# EAGLE design DispenserV2.0 (EAGLE 9.3.1)

## Sheet 1 of 2
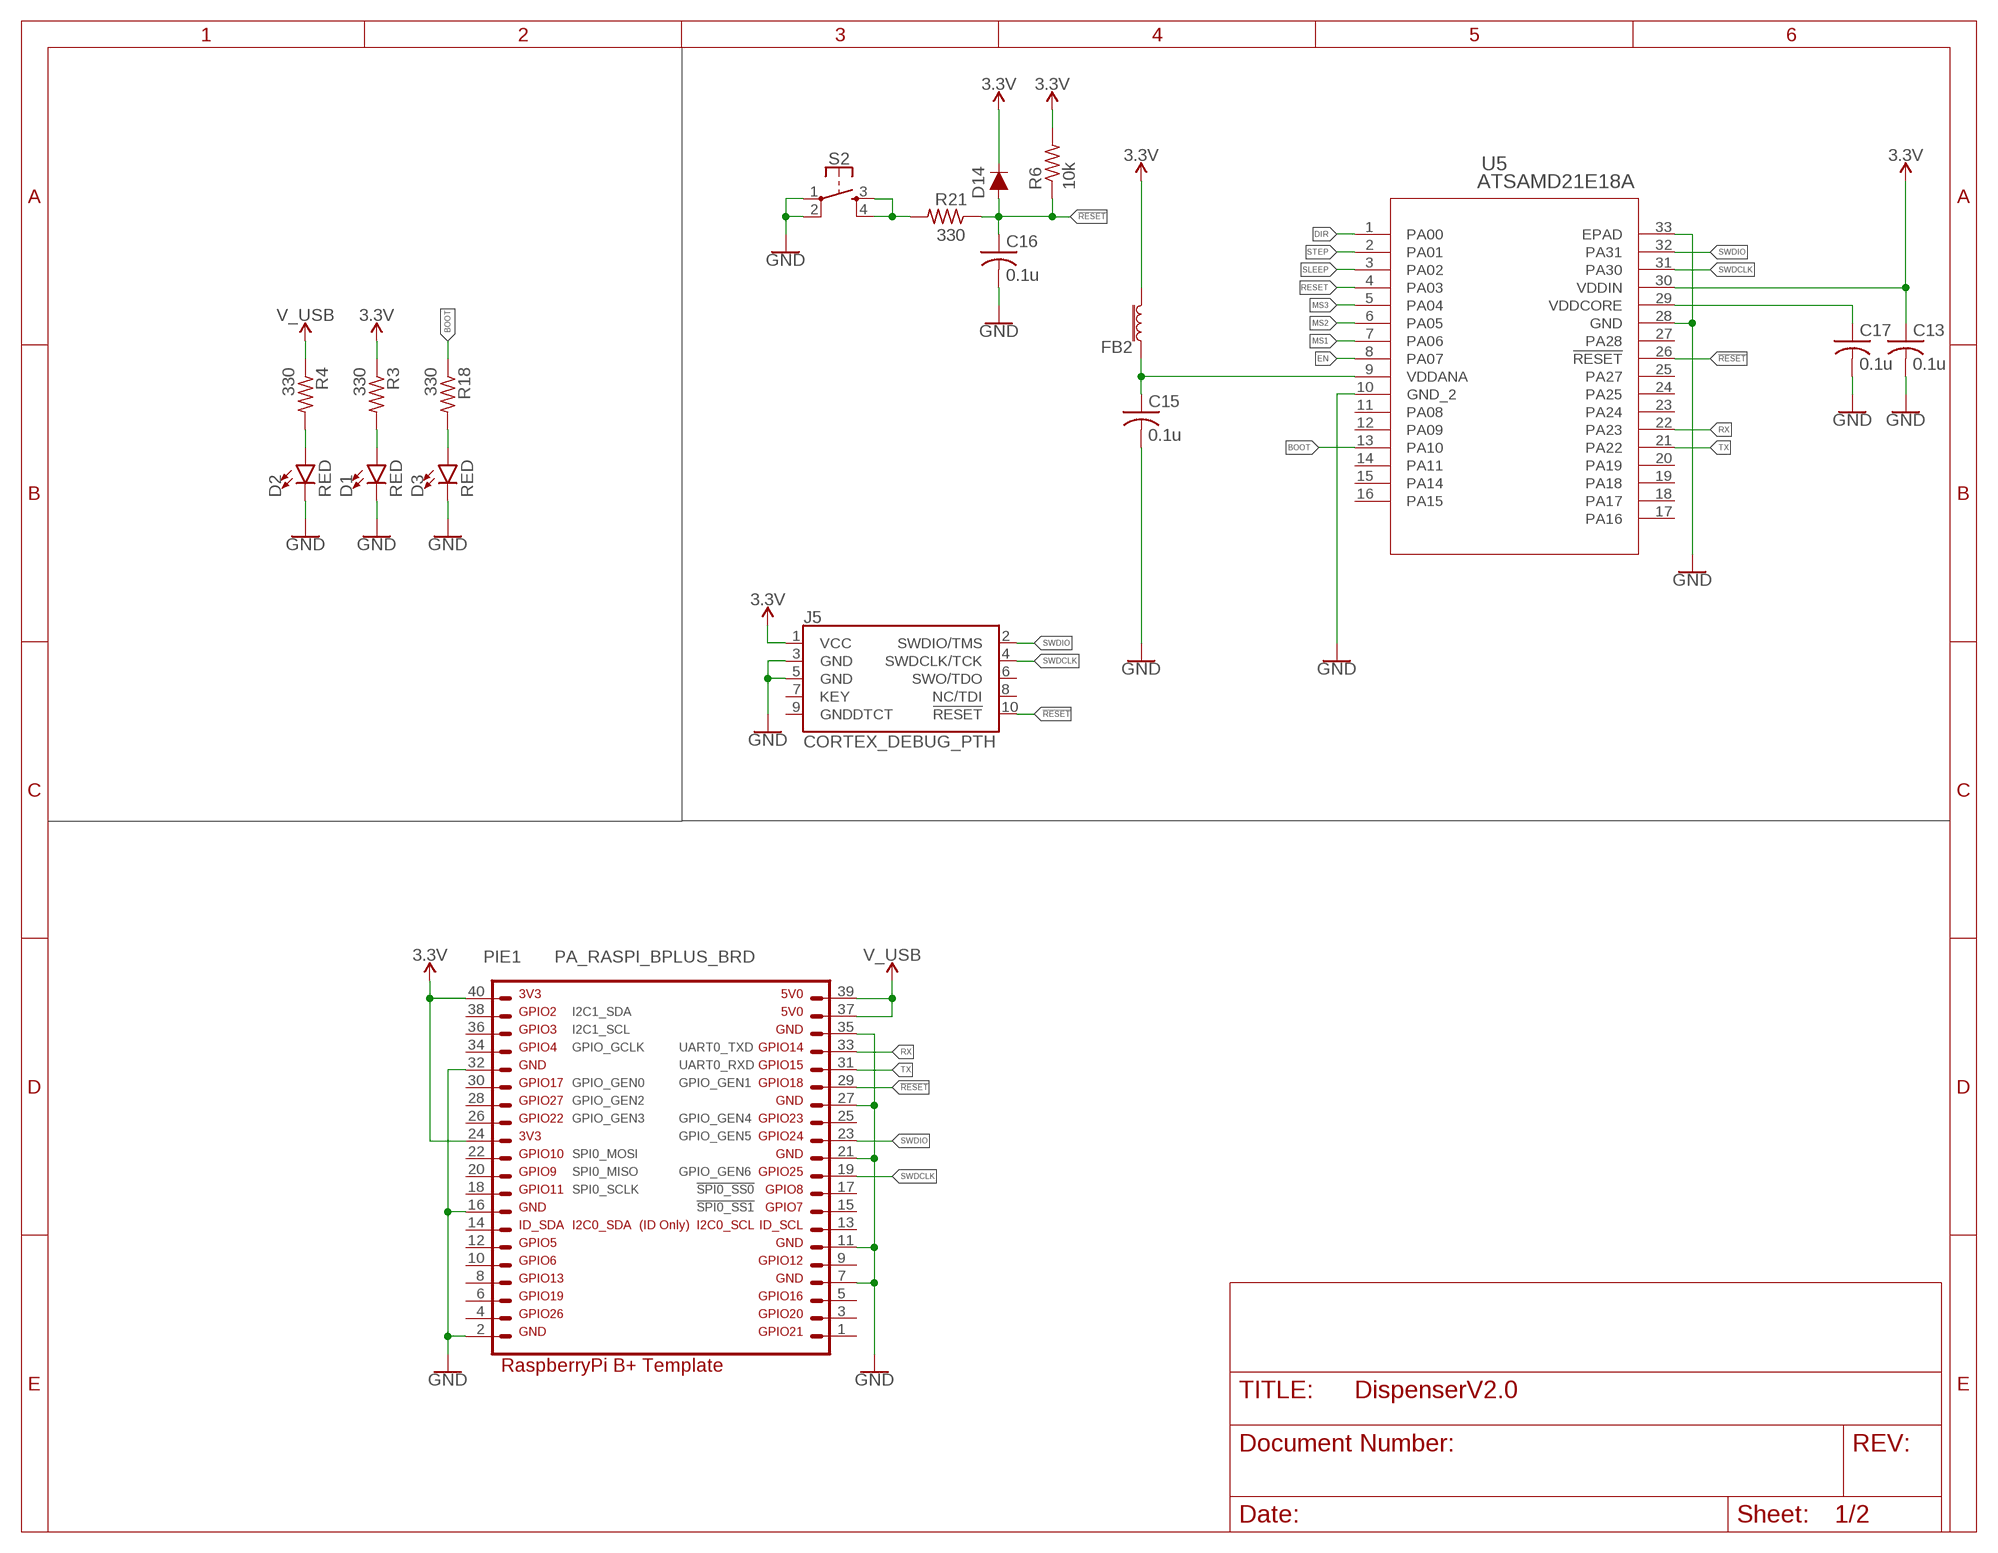
[diagram p0: schematic, sheet 1]

### Parts
C13  0.1u  C-USC0603K  [C0603K]
C15  0.1u  C-USC0603K  [C0603K]
C16  0.1u  C-USC0603K  [C0603K]
C17  0.1u  C-USC0603K  [C0603K]
D1  RED  LED-RED0603  [LED-0603]
D2  RED  LED-RED0603  [LED-0603]
D3  RED  LED-RED0603  [LED-0603]
D14  250mA/100V  DIODE-BAS16J  [SOD-323]
FB2  30Ω/1.8A  FERRITE_BEAD-0603  [0603]
J5  CORTEX_DEBUG_PTH  [2X5-PTH-1.27MM]
PIE1  PA_RASPI_BPLUS_BRD  [PA_RASPI_PLATE_BPLUS]
R3  330  R-US_R0603  [R0603]
R4  330  R-US_R0603  [R0603]
R6  10k  R-US_R0603  [R0603]
R18  330  R-US_R0603  [R0603]
R21  330  R-US_R0603  [R0603]
S2  MOMENTARY-SWITCH-SPST-2-SMD-5.2MM  [TACTILE_SWITCH_SMD_5.2MM]
U5  ATSAMD21E18A  ATSAMD21E18A-MUT  [QFN32_5X5MC]

### Nets
3.3V: C13.1 D14.C FB2.2 J5.1(VCC) PIE1.24 PIE1.40 R3.1 R6.2 U5.30(VDDIN) ; also sheet 2
!RESET: C16.1 D14.A J5.10(!RESET) PIE1.29 R6.1 R21.1 U5.26(!RESET)
BOOT: R18.1 U5.13(PA10)
DIR: U5.1(PA00) ; also sheet 2
EN: U5.8(PA07) ; also sheet 2
GND: C13.2 C15.2 C16.2 C17.2 D1.C D2.C D3.C J5.3(GND) J5.5(GND) PIE1.2 PIE1.7 PIE1.11 PIE1.16 PIE1.21 PIE1.27 PIE1.32 PIE1.35 S2.1 S2.2 U5.10(GND_2) U5.28(GND) U5.33(EPAD) ; also sheet 2
MS1: U5.7(PA06) ; also sheet 2
MS2: U5.6(PA05) ; also sheet 2
MS3: U5.5(PA04) ; also sheet 2
N$1: D1.A R3.2
N$4: C15.1 FB2.1 U5.9(VDDANA)
N$11: C17.1 U5.29(VDDCORE)
N$14: D2.A R4.2
N$17: D3.A R18.2
N$34: R21.2 S2.3 S2.4
RESET: U5.4(PA03) ; also sheet 2
RX: PIE1.33 U5.22(PA23)
SLEEP: U5.3(PA02) ; also sheet 2
STEP: U5.2(PA01) ; also sheet 2
SWDCLK: J5.4(SWDCLK/TCK) PIE1.19 U5.31(PA30)
SWDIO: J5.2(SWDIO/TMS) PIE1.23 U5.32(PA31)
TX: PIE1.31 U5.21(PA22)
V_USB: PIE1.37 PIE1.39 R4.1
Unconnected: J5.6(SWO/TDO) J5.7(KEY) J5.8(NC/TDI) J5.9(GNDDTCT) PIE1.1 PIE1.3 PIE1.4 PIE1.5 PIE1.6 PIE1.8 PIE1.9 PIE1.10 PIE1.12 PIE1.13 PIE1.14 PIE1.15 PIE1.17 PIE1.18 PIE1.20 PIE1.22 PIE1.25 PIE1.26 PIE1.28 PIE1.30 PIE1.34 PIE1.36 PIE1.38 U5.11(PA08) U5.12(PA09) U5.14(PA11) U5.15(PA14) U5.16(PA15) U5.17(PA16) U5.18(PA17) U5.19(PA18) U5.20(PA19) U5.23(PA24) U5.24(PA25) U5.25(PA27) U5.27(PA28)

## Sheet 2 of 2
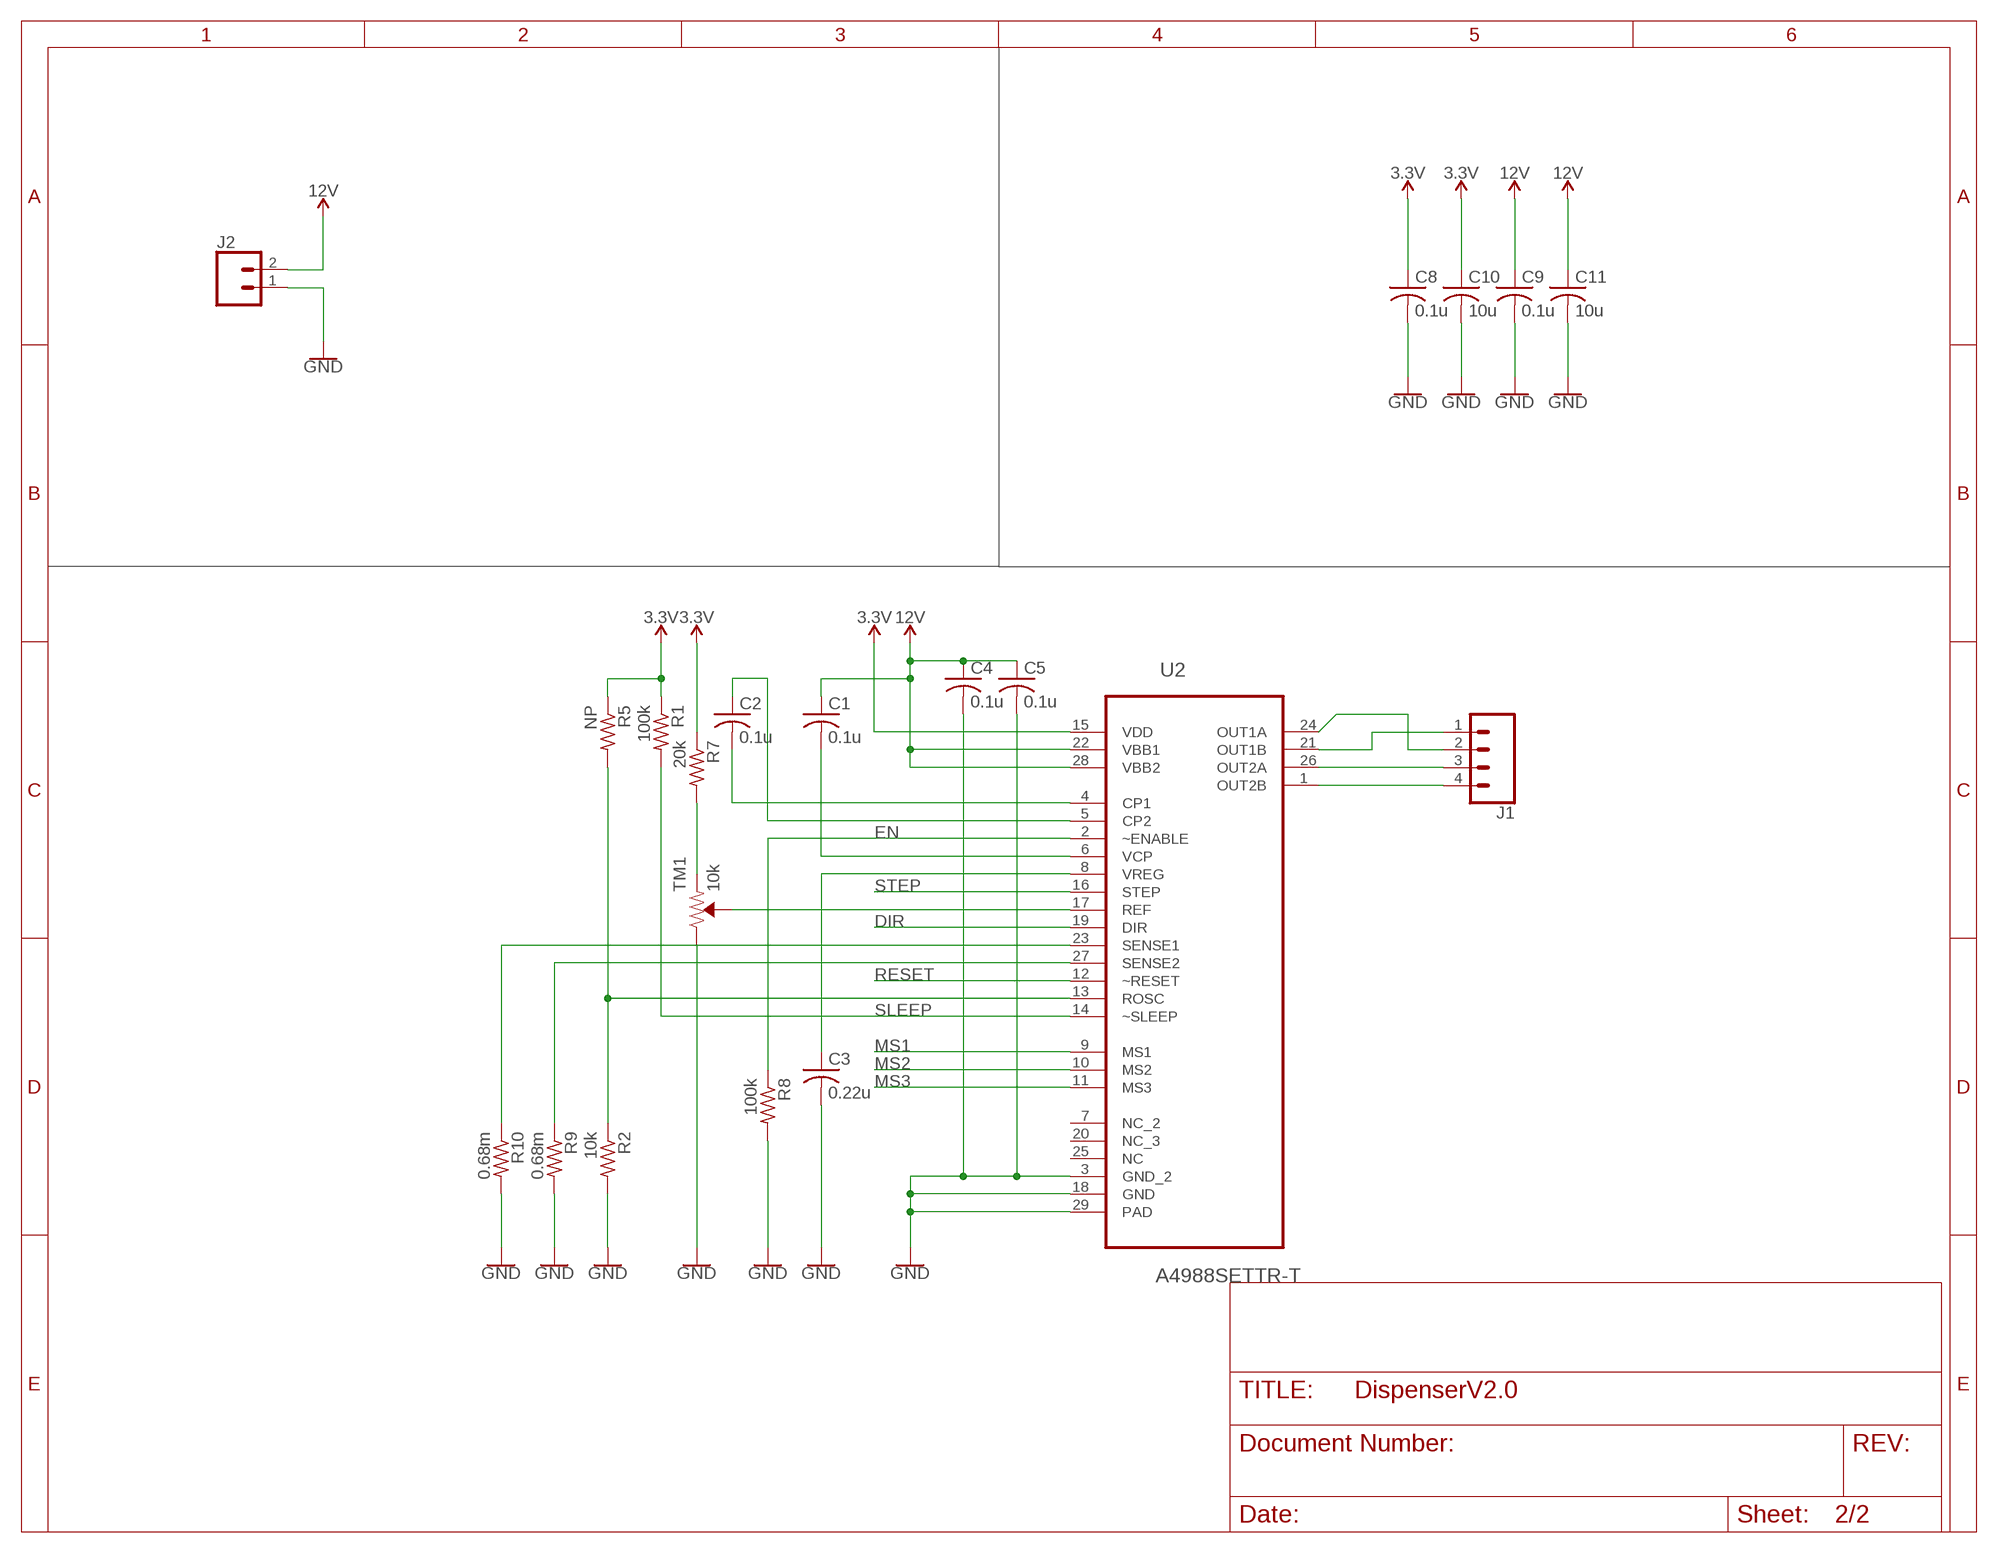
[diagram p1: schematic, sheet 2]

### Parts
C1  0.1u  C-USC0402  [C0402]
C2  0.1u  C-USC0402  [C0402]
C3  0.22u  C-USC0402  [C0402]
C4  0.1u  C-USC0402  [C0402]
C5  0.1u  C-USC0402  [C0402]
C8  0.1u  C-USC0603  [C0603]
C9  0.1u  C-USC0603  [C0603]
C10  10u  C-USC1206  [C1206]
C11  10u  C-USC1206  [C1206]
J1  CONN_04  [1X04]
J2  CONN_023.5MM  [SCREWTERMINAL-3.5MM-2]
R1  100k  R-US_R0402  [R0402]
R2  10k  R-US_R0402  [R0402]
R5  NP  R-US_R0402  [R0402]
R7  20k  R-US_R0402  [R0402]
R8  100k  R-US_R0402  [R0402]
R9  0.68m  R-US_R0805  [R0805]
R10  0.68m  R-US_R0805  [R0805]
TM1  10k  TRIMPOT-SMD-3MM-OPEN-1/10W-25%  [TRIMPOT-SMD-TC33X]
U2  A4988SETTR-T  [QFN50P500X500X100-29N]

### Nets
3.3V: C8.1 C10.1 R1.1 R5.1 R7.1 U2.15(VDD) ; also sheet 1
12V: C1.1 C4.1 C5.1 C9.1 C11.1 J2.2 U2.22(VBB1) U2.28(VBB2)
DIR: U2.19(DIR) ; also sheet 1
EN: R8.1 U2.2(~ENABLE) ; also sheet 1
GND: C3.2 C4.2 C5.2 C8.2 C9.2 C10.2 C11.2 J2.1 R2.2 R8.2 R9.2 R10.2 TM1.1(CW) U2.3(GND_2) U2.18(GND) U2.29(PAD) ; also sheet 1
MS1: U2.9(MS1) ; also sheet 1
MS2: U2.10(MS2) ; also sheet 1
MS3: U2.11(MS3) ; also sheet 1
N$2: J1.4 U2.1(OUT2B)
N$3: J1.3 U2.26(OUT2A)
N$5: R2.1 R5.2 U2.13(ROSC)
N$6: J1.1 U2.21(OUT1B)
N$7: J1.2 U2.24(OUT1A)
N$18: TM1.2(WIPER) U2.17(REF)
N$19: R7.2 TM1.3(CCW)
N$20: C3.1 U2.8(VREG)
N$21: R10.1 U2.23(SENSE1)
N$22: R9.1 U2.27(SENSE2)
N$27: C1.2 U2.6(VCP)
N$29: C2.2 U2.4(CP1)
N$30: C2.1 U2.5(CP2)
RESET: U2.12(~RESET) ; also sheet 1
SLEEP: R1.2 U2.14(~SLEEP) ; also sheet 1
STEP: U2.16(STEP) ; also sheet 1
Unconnected: U2.7(NC_2) U2.20(NC_3) U2.25(NC)

## Library data of the parts
C1-C5 C8-C11 C13 C15-C17 = adafruit:C-US: CAPACITOR, American symbol
D1-D3 = SparkFun-LED:LED-RED: Red SMD LED Used in manufacturing of most products at SparkFun Packages: 0603 - SMD 0603 package [Product Link] <http://docs.avagotech.com/docs/AV02-0551EN> 0603 SMART - SMD 0603 SMART package ( more efficient and expensive)[Product Link] <http://www.osram-os.com/Graphics/XPic2/00077099_0.pdf> 1206 - SMD1206 package [Product Link] <https://www.sparkfun.com/datasheets/DevTools/LilyPad/Q150OVS4.pdff> SparkFun Products: Pro Mini 328 -5V <https://www.sparkfun.com/products/821> RedBoard <https://www.sparkfun.com/products/12757> IOIO-OTG <https://www.sparkfun.com/products/13613>; PROD_ID: DIO-00819
D14 = SparkFun-DiscreteSemi:DIODE: Diode These are standard reverse protection diodes and small signal diodes. SparkFun Products: SparkFun SparkPunk Sound Kit <https://www.sparkfun.com/products/11177> SparkFun ESP8266 Thing <https://www.sparkfun.com/products/13231>; PROD_ID: DIO-09646
FB2 = SparkFun-Coils:FERRITE_BEAD: Ferrite Bead (blocks, cores, rings, chokes, etc.) Inductor with layers of ferrite used to suppress high frequencies. Often used to isolate high frequency noise. SparkFun Products: IOIO-OTG - V2.2 <https://www.sparkfun.com/products/13613> SparkFun SAMD21 Mini Breakout <https://www.sparkfun.com/products/13664> SparkFun 6 Degrees of Freedom Breakout - LSM6DS3 <https://www.sparkfun.com/products/13339> SparkFun SAMD21 Dev Breakout <https://www.sparkfun.com/products/13672>; PROD_ID: NDUC-13805
J1 = SparkFun-Connectors:CONN_04: Multi connection point. Often used as Generic Header-pin footprint for 0.1 inch spaced/style header connections On any of the 0.1 inch spaced packages, you can populate with these: Break Away Headers - Straight <https://www.sparkfun.com/products/116> (PRT-00116) Break Away Male Headers - Right Angle <https://www.sparkfun.com/products/553> (PRT-00553) Female Headers <https://www.sparkfun.com/products/115> (PRT-00115) Break Away Headers - Machine Pin <https://www.sparkfun.com/products/117> (PRT-00117) Break Away Female Headers - Swiss Machine Pin <https://www.sparkfun.com/products/743> (PRT-00743) For SCREWTERMINALS and SPRING TERMINALS visit here: Screw Terimnals on SparkFun.com <https://www.sparkfun.com/search/results?term=Screw+Terminals> (5mm/3.5mm/2.54mm spacing) This device is also useful as a general connection point to wire up your design to another part of your project. Our various solder wires solder well into these plated through hole pads. Hook-Up Wire - Assortment (Stranded, 22 AWG) <https://www.sparkfun.com/products/11375> (PRT-11375) Hook-Up Wire - Assortment (Solid Core, 22 AWG) <https://www.sparkfun.com/products/11367> (PRT-11367) View the entire wire category on our website here <https://www.sparkfun.com/categories/141> Special notes: Molex polarized connector foot print use with SKU : PRT-08231 with associated crimp pins and housings. 1MM SMD Version SKU: PRT-10208; PROD_ID: CONN-09696
J2 = SparkFun-Connectors:CONN_02: Multi connection point. Often used as Generic Header-pin footprint for 0.1 inch spaced/style header connections On any of the 0.1 inch spaced packages, you can populate with these: Break Away Headers - Straight <https://www.sparkfun.com/products/116> (PRT-00116) Break Away Male Headers - Right Angle <https://www.sparkfun.com/products/553> (PRT-00553) Female Headers <https://www.sparkfun.com/products/115> (PRT-00115) Break Away Headers - Machine Pin <https://www.sparkfun.com/products/117> (PRT-00117) Break Away Female Headers - Swiss Machine Pin <https://www.sparkfun.com/products/743> (PRT-00743) For SCREWTERMINALS and SPRING TERMINALS visit here: Screw Terimnals on SparkFun.com <https://www.sparkfun.com/search/results?term=Screw+Terminals> (5mm/3.5mm/2.54mm spacing) This device is also useful as a general connection point to wire up your design to another part of your project. Our various solder wires solder well into these plated through hole pads. Hook-Up Wire - Assortment (Stranded, 22 AWG) <https://www.sparkfun.com/products/11375> (PRT-11375) Hook-Up Wire - Assortment (Solid Core, 22 AWG) <https://www.sparkfun.com/products/11367> (PRT-11367) View the entire wire category on our website here <https://www.sparkfun.com/categories/141> Special notes: Molex polarized connector foot print use with: PRT-08233 with associated crimp pins and housings. 2.54_SCREWTERM for use with PRT-10571. 3.5mm Screw Terminal footprints for PRT-08084 5mm Screw Terminal footprints for use with PRT-08432; PROD_ID: CONN-08399
J5 = SparkFun-Connectors:CORTEX_DEBUG: Cortex Debug Connector - 10 pin Supports JTAG debug, Serial Wire debug, and Serial Wire Viewer. PTH and SMD connector options available. General Connector Information <http://infocenter.arm.com/help/topic/com.arm.doc.faqs/attached/13634/cortex_debug_connectors.pdf> Products: PTH Connector <http://www.digikey.com/product-detail/en/cnc-tech/3220-10-0100-00/1175-1627-ND/3883661> -via Digi-Key SparkFun PSoc <https://www.sparkfun.com/products/13229> SparkFun T <https://www.sparkfun.com/products/13810>
PIE1 = PatternAgents-Boards:PA_RASPI_BPLUS_BRD: PatternAgents Raspberry Pi B+ Template Source LBR : http://www.patternagents.com Github : https://github.com/patternagents License : http://creativecommons.org/licenses/by-sa/4.0/ (Creative Commons 4.0) THIS SOFTWARE IS PROVIDED BY THE CONTRIBUTORS "AS IS" AND WITHOUT ANY EXPRESS OR IMPLIED WARRANTIES, INCLUDING, BUT NOT LIMITED TO, THE IMPLIED WARRANTIES OF MERCHANTABILITY AND FITNESS FOR A PARTICULAR PURPOSE ARE DISCLAIMED. IN NO EVENT SHALL THE COPYRIGHT OWNER OR CONTRIBUTORS BE LIABLE FOR ANY DIRECT, INDIRECT, INCIDENTAL, SPECIAL, EXEMPLARY, OR CONSEQUENTIAL DAMAGES (INCLUDING, BUT NOT LIMITED TO, PROCUREMENT OF SUBSTITUTE GOODS OR SERVICES; LOSS OF USE, DATA, OR PROFITS; OR BUSINESS INTERRUPTION) HOWEVER CAUSED AND ON ANY THEORY OF LIABILITY, WHETHER IN CONTRACT, STRICT LIABILITY, OR TORT (INCLUDING NEGLIGENCE OR OTHERWISE) ARISING IN ANY WAY OUT OF THE USE OF THIS SOFTWARE, EVEN IF ADVISED OF THE POSSIBILITY OF SUCH DAMAGE.
R1-R10 R18 R21 = adafruit:R-US_: RESISTOR, American symbol
S2 = SparkFun-Switches:MOMENTARY-SWITCH-SPST-2: Momentary Switch (Pushbutton) - SPST - Two Circuits Normally-open (NO) SPST momentary switches (buttons, pushbuttons). Schematic symbol includes two switch circuits. Variants SMD-4.6MMX2.8MM - 4.60mm x 2.80mm Tactile Momentary Button Switch - Used on SparkFun SAMD21 Mini Breakout <https://www.sparkfun.com/products/13664> SMD-5.2MM - Mini Pushbutton Switch - SMD <https://www.sparkfun.com/products/8720> - Used on Arduino Pro Mini <https://www.sparkfun.com/products/11114>; PROD_ID: SWCH-08247; SF_SKU: COM-08720
TM1 = SparkFun-Resistors:TRIMPOT: Trimming Potentiometer (Trimpot) Three-terminal potentiometers, with an adjustable wiper and two adjustable resistors. A pot can be used to create a configurable voltage divider, or as a variable resistor. "Trimpots" are a subset of potentiometers, usually intended for "set-and-forget" applications. They're often more delicate than standard potentiometers - rated for fewer turns. Variants PTH-KNOB - PTH Trimpot w/ finger-adjustable knob Trimpot 10K with Knob <https://www.sparkfun.com/products/9806> (COM-09806) Datasheet <http://www.sparkfun.com/datasheets/Components/General/TSR-3386.pdf> SMD-3MM-CLOSED-FRAME - SMD 3mm Square Closed-Frame Trimpot Used on e.g. EasyDriver - Stepper Motor Driver <https://www.sparkfun.com/products/12779> Datasheet <http://www.bitechnologies.com/pdfs/22.pdf> (22AR10KTR) SMD-5MM - SMD 5mm Square Closed-Frame Trimpot Used on e.g. IOIO-OTG - V2.2 <https://www.sparkfun.com/products/13613> Datasheet <http://www.vishay.com/docs/51008/ts53.pdf> (TS53YL502MR10) SMD-3MM-1/10W-25% - 3mm Square Open-Frame Trimpot Used on e.g. SparkFun Shapeoko <https://www.sparkfun.com/products/13899> Datasheet <http://www.bourns.com/docs/Product-Datasheets/TC33.pdf> (TC33X-2-103E); PROD_ID: RES-12428
U2 = A4988SETTR-T:A4988SETTR-T: DMOS Microstepping Driver with Translator and Overcurrent Protection; AVAILABILITY: Good; DESCRIPTION: DMOS Stepping Motor Driver 28-Pin QFN EP T/R; MF: Allegro MicroSystems LLC; MP: A4988SETTRT; PACKAGE: QFN-28 Allegro MicroSystems LLC; PRICE: 2.01 USD
U5 = ATSAMD21E18A-MUT:ATSAMD21E18A-MUT; BUILT_BY: EMA_Molly; COPYRIGHT: Copyright (C) 2018 Accelerated Designs. All rights reserved; MANUFACTURER_PART_NUMBER: ATSAMD21E18A-MUT; VENDOR: Microchip

## Board
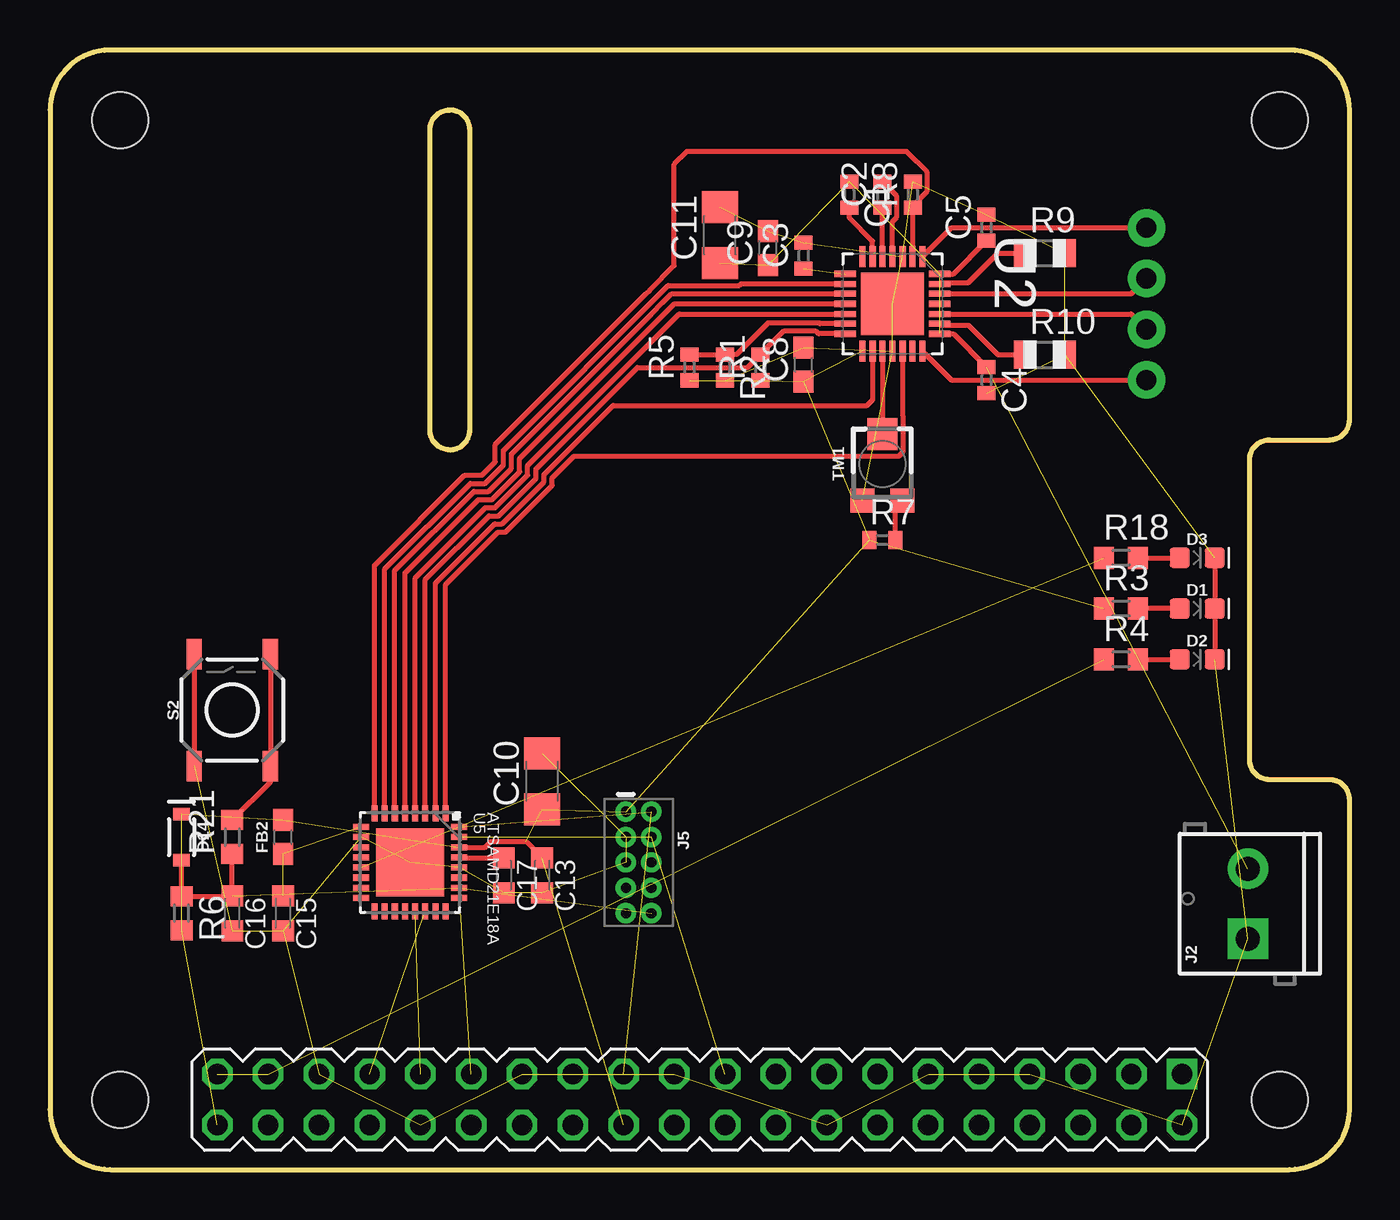
[diagram p2: board, top side]
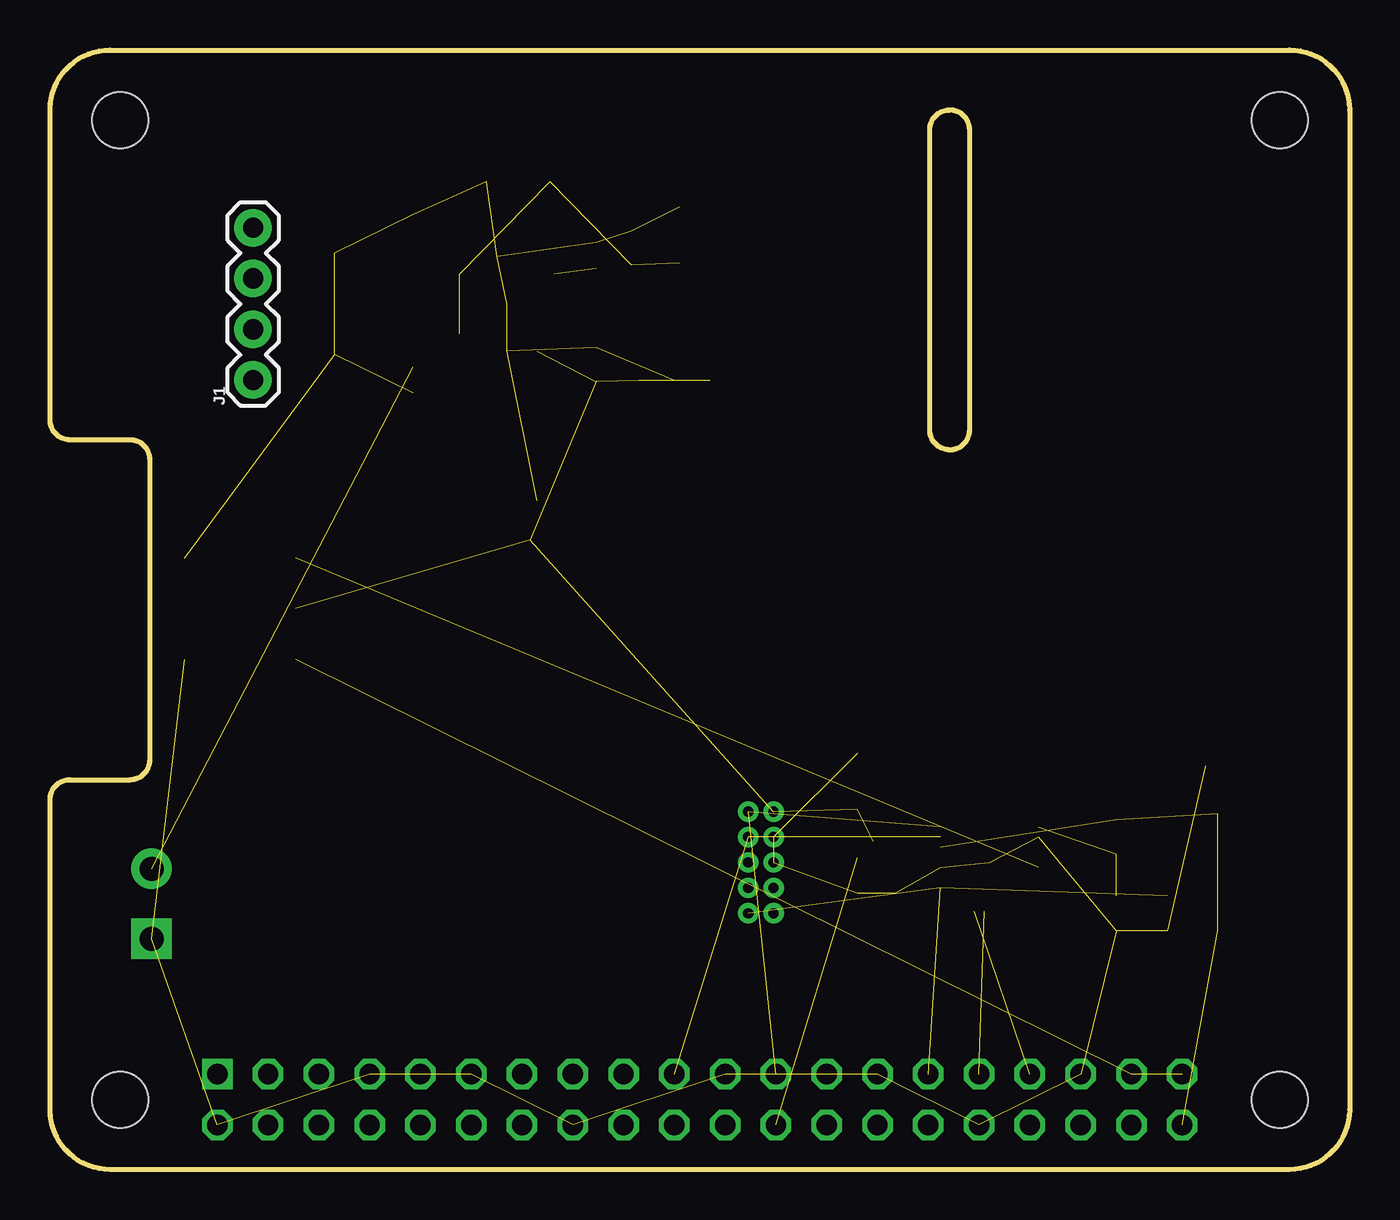
[diagram p3: board, bottom side, seen from below]

Size 65 x 56 mm. Coordinates in mm from the lower left corner, seen from the top.
Copper layers (1*16): Top 0.035mm / dielectric 1.5mm / Bottom 0.035mm
Design rules "default": minimum track width 6mil, minimum drill 0.35mm, track to track 6mil, track to pad 6mil, pad to pad 6mil, via to via 6mil, smd to smd 6mil, copper to edge 40mil, drill to drill 6mil, minimum pad ring 10mil, minimum via ring 8mil, stop-mask expansion 4mil, vias tented up to drill 0mil, thermal gap 10mil

### Footprints (pad centres in the part's own frame; a part is rotated, then mirrored left to right if it is on the bottom)
C0402 = smd 0.7 x 0.9: 1 -0.65,0; 2 0.65,0
C0603 = smd 1.1 x 1: 1 -0.85,0; 2 0.85,0
C1206 = smd 1.6 x 1.8: 1 -1.4,0; 2 1.4,0
C0603K = smd 1.05 x 1.08: 1 -0.875,0; 2 0.875,0
LED-0603 = smd 1 x 1: A -0.877,0; C 0.877,0
SOD-323 = smd 0.63 x 0.83: A 1.15,0; C -1.15,0
0603 = smd 1.1 x 1: 1 -0.85,0; 2 0.85,0
1X04 = drill 1.016 pad 1.88: 1 0,0; 2 2.54,0; 3 5.08,0; 4 7.62,0
SCREWTERMINAL-3.5MM-2 = drill 1.2 pad 2.032 square: 1 0,0 | drill 1.2 pad 2.032: 2 3.5,0
2X5-PTH-1.27MM = drill 0.508 pad 1: 1 -2.54,-0.635; 2 -2.54,0.635; 3 -1.27,-0.635; 4 -1.27,0.635; 5 0,-0.635; 6 0,0.635; 7 1.27,-0.635; 8 1.27,0.635; 9 2.54,-0.635; 10 2.54,0.635
PA_RASPI_PLATE_BPLUS = drill 1.016 square: 1 8.37,51.23 | drill 1.016 octagon: 2 8.37,53.77; 3 10.91,51.23; 4 10.91,53.77; 5 13.45,51.23; 6 13.45,53.77; 7 15.99,51.23; 8 15.99,53.77; 9 18.53,51.23; 10 18.53,53.77; 11 21.07,51.23; 12 21.07,53.77; 13 23.61,51.23; 14 23.61,53.77; 15 26.15,51.23; 16 26.15,53.77; 17 28.69,51.23; 18 28.69,53.77; 19 31.23,51.23; 20 31.23,53.77; 21 33.77,51.23; 22 33.77,53.77; 23 36.31,51.23; 24 36.31,53.77; 25 38.85,51.23; 26 38.85,53.77; 27 41.39,51.23; 28 41.39,53.77; 29 43.93,51.23; 30 43.93,53.77; 31 46.47,51.23; 32 46.47,53.77; 33 49.01,51.23; 34 49.01,53.77; 35 51.55,51.23; 36 51.55,53.77; 37 54.09,51.23; 38 54.09,53.77; 39 56.63,51.23; 40 56.63,53.77 | hole 2.8: 3.5,3.5; 3.5,52.5; 61.5,52.5; 61.5,3.5
R0402 = smd 0.7 x 0.9: 1 -0.65,0; 2 0.65,0
R0603 = smd 1 x 1.1: 1 -0.85,0; 2 0.85,0
R0805 = smd 1.1 x 1.4: 1 -1,0; 2 1,0
TACTILE_SWITCH_SMD_5.2MM = smd 1.524 x 0.762: 1 -2.794,1.905; 2 2.794,1.905; 3 -2.794,-1.905; 4 2.794,-1.905
TRIMPOT-SMD-TC33X = smd 1.2 x 1.2: 1 -1,-1.825; 3 1,-1.825 | smd 1.5 x 1.6: 2 0,1.5
QFN50P500X500X100-29N = smd 1.067 x 0.305: 1 -2.362,1.499; 2 -2.362,0.991; 3 -2.362,0.508; 4 -2.362,0; 5 -2.362,-0.508; 6 -2.362,-0.991; 7 -2.362,-1.499; 15 2.362,-1.499; 16 2.362,-0.991; 17 2.362,-0.508; 18 2.362,0; 19 2.362,0.508; 20 2.362,0.991; 21 2.362,1.499 | smd 0.305 x 1.067: 8 -1.499,-2.362; 9 -0.991,-2.362; 10 -0.508,-2.362; 11 0,-2.362; 12 0.508,-2.362; 13 0.991,-2.362; 14 1.499,-2.362; 22 1.499,2.362; 23 0.991,2.362; 24 0.508,2.362; 25 0,2.362; 26 -0.508,2.362; 27 -0.991,2.362; 28 -1.499,2.362 | smd 3.15 x 3.15: 29 0,0
QFN32_5X5MC = smd 0.813 x 0.305: 1 -2.451,1.778; 2 -2.451,1.27; 3 -2.451,0.762; 4 -2.451,0.254; 5 -2.451,-0.254; 6 -2.451,-0.762; 7 -2.451,-1.27; 8 -2.451,-1.778; 17 2.451,-1.778; 18 2.451,-1.27; 19 2.451,-0.762; 20 2.451,-0.254; 21 2.451,0.254; 22 2.451,0.762; 23 2.451,1.27; 24 2.451,1.778 | smd 0.305 x 0.813: 9 -1.778,-2.451; 10 -1.27,-2.451; 11 -0.762,-2.451; 12 -0.254,-2.451; 13 0.254,-2.451; 14 0.762,-2.451; 15 1.27,-2.451; 16 1.778,-2.451; 25 1.778,2.451; 26 1.27,2.451; 27 0.762,2.451; 28 0.254,2.451; 29 -0.254,2.451; 30 -0.762,2.451; 31 -1.27,2.451; 32 -1.778,2.451 | smd 3.404 x 3.404: 33 0,0

### Placement (x,y rotation side)
C1  39.98,48.76 270 top
C2  41.63,48.76 90 top
C3  37.7,45.71 90 top
C4  46.84,39.49 270 top
C5  46.84,47.11 90 top
C8  37.7,40.25 90 top
C9  35.92,46.09 90 top
C10  24.61,19.42 90 top
C11  33.5,46.73 90 top
C13  24.61,14.72 270 top
C15  11.66,12.82 270 top
C16  9.12,12.82 270 top
C17  22.71,14.72 270 top
D1  57.38,28.06 0 top
D2  57.38,25.52 0 top
D3  57.38,30.6 0 top
D14  6.58,16.63 270 top
FB2  11.66,16.63 90 top
J1  54.84,39.49 90 bottom
J2  59.92,11.55 90 top
J5  29.44,15.36 270 top
PIE1  65,56 180 top
R1  35.54,40.12 90 top
R2  33.76,40.12 270 top
R3  53.57,28.06 0 top
R4  53.57,25.52 0 top
R5  31.98,40.12 90 top
R6  6.58,12.82 270 top
R7  41.63,31.49 0 top
R8  43.16,48.76 90 top
R9  49.76,45.84 0 top
R10  49.76,40.76 0 top
R18  53.57,30.6 0 top
R21  9.12,16.63 90 top
S2  9.12,22.98 90 top
TM1  41.63,35.3 0 top
U2  42.14,43.3 270 top
U5  18.01,15.36 270 top

### Tracks (layer width: path | path; a pad name or v marks a point on that pad's centre or on a via)
3.3V  (13 unrouted)
  Top 0.254: U5.30 21.77,16.12 22.05,16.4 23.81,16.4 C13.1
12V  (5 unrouted)
  Top 0.254: U2.28 45.18,44.8 C5.1 | U2.22 45.18,41.8 C4.1
!RESET  (3 unrouted)
  Top 0.254: D14.A R6.1 9.1,13.67 C16.1 R21.1
BOOT  (1 unrouted)
DIR
  Top 0.254: U2.19 42.65,37.73 42.66,37.71 42.66,35.88 42.46,35.68 26.21,35.68 25.12,34.59 25.12,34.22 22.78,31.88 22.41,31.88 19.79,29.26 U5.1
EN
  Top 0.254: U2.2 43.16,45.69 R8.1 43.16,48.22 43.89,48.95 43.89,49.88 42.84,50.92 31.85,50.92 31.22,50.28 31.22,45.2 30.01,44 29.82,43.81 22.27,36.26 22.27,35.4 21.6,34.73 20.74,34.73 16.23,30.22 U5.8
GND  (34 unrouted)
  Top 0.254: S2.2 S2.1 | D3.C D1.C D2.C
MS1
  Top 0.254: U2.9 34.56,44.29 34.49,44.21 30.92,44.21 22.68,35.97 22.68,35.23 21.77,34.32 21.03,34.32 16.74,30.03 U5.7
MS2
  Top 0.254: U2.10 31.09,43.81 30.65,43.36 30.08,42.79 23.08,35.8 23.08,35.06 21.94,33.92 21.2,33.92 17.25,29.96 U5.6
MS3
  Top 0.254: U2.11 31.22,43.3 30.33,42.41 30.2,42.28 23.49,35.57 23.49,34.89 22.11,33.51 21.43,33.51 17.76,29.84 U5.5
N$1
  Top 0.254: D1.A R3.2
N$2
  Top 0.254: U2.1 45.09,47.11 J1.4
N$3
  Top 0.254: U2.26 54.08,43.81 J1.3
N$4  (2 unrouted)
N$5
  Top 0.254: U2.13 38.51,42.31 38.48,42.34 35.9,42.34 34.34,40.77 R2.1 R5.2
N$6
  Top 0.254: U2.21 45.09,39.49 J1.1
N$7
  Top 0.254: U2.24 54.08,42.79 J1.2
N$11
  Top 0.254: U5.29 20.48,15.6 C17.1
N$14
  Top 0.254: R4.2 D2.A
N$17
  Top 0.254: R18.2 D3.A
N$18
  Top 0.254: U2.17 TM1.2
N$19
  Top 0.254: R7.2 42.28,33.12 TM1.3
N$20  (1 unrouted)
N$21
  Top 0.254: U2.23 44.58,42.23 45.94,42.23 47.41,40.76 R10.1
N$22
  Top 0.254: U2.27 44.58,44.37 45.94,44.37 47.41,45.84 R9.1
N$27
  Top 0.254: U2.6 41.15,46.45 39.98,47.62 C1.2
N$29
  Top 0.254: U2.4 42.14,47.42 42.36,47.64 42.36,48.68 C2.2
N$30
  Top 0.254: U2.5 C2.1
N$34
  Top 0.254: S2.4 S2.3 11.03,19.38 R21.2
RESET
  Top 0.254: U2.12 31.47,42.79 23.9,35.22 23.9,34.73 22.27,33.1 21.78,33.1 18.26,29.58 U5.4
RX  (1 unrouted)
SLEEP
  Top 0.254: U2.14 38.44,41.8 38.31,41.93 36.69,41.93 35.59,40.83 R1.2 34.89,40.12 29.38,40.12 24.3,35.05 24.3,34.56 22.44,32.7 21.95,32.7 18.77,29.52 U5.3
STEP
  Top 0.254: U2.16 41.15,38.5 40.87,38.22 28.17,38.22 24.71,34.76 24.71,34.39 22.61,32.29 22.24,32.29 19.28,29.33 U5.2
SWDCLK  (2 unrouted)
SWDIO  (2 unrouted)
TX  (1 unrouted)
V_USB  (2 unrouted)